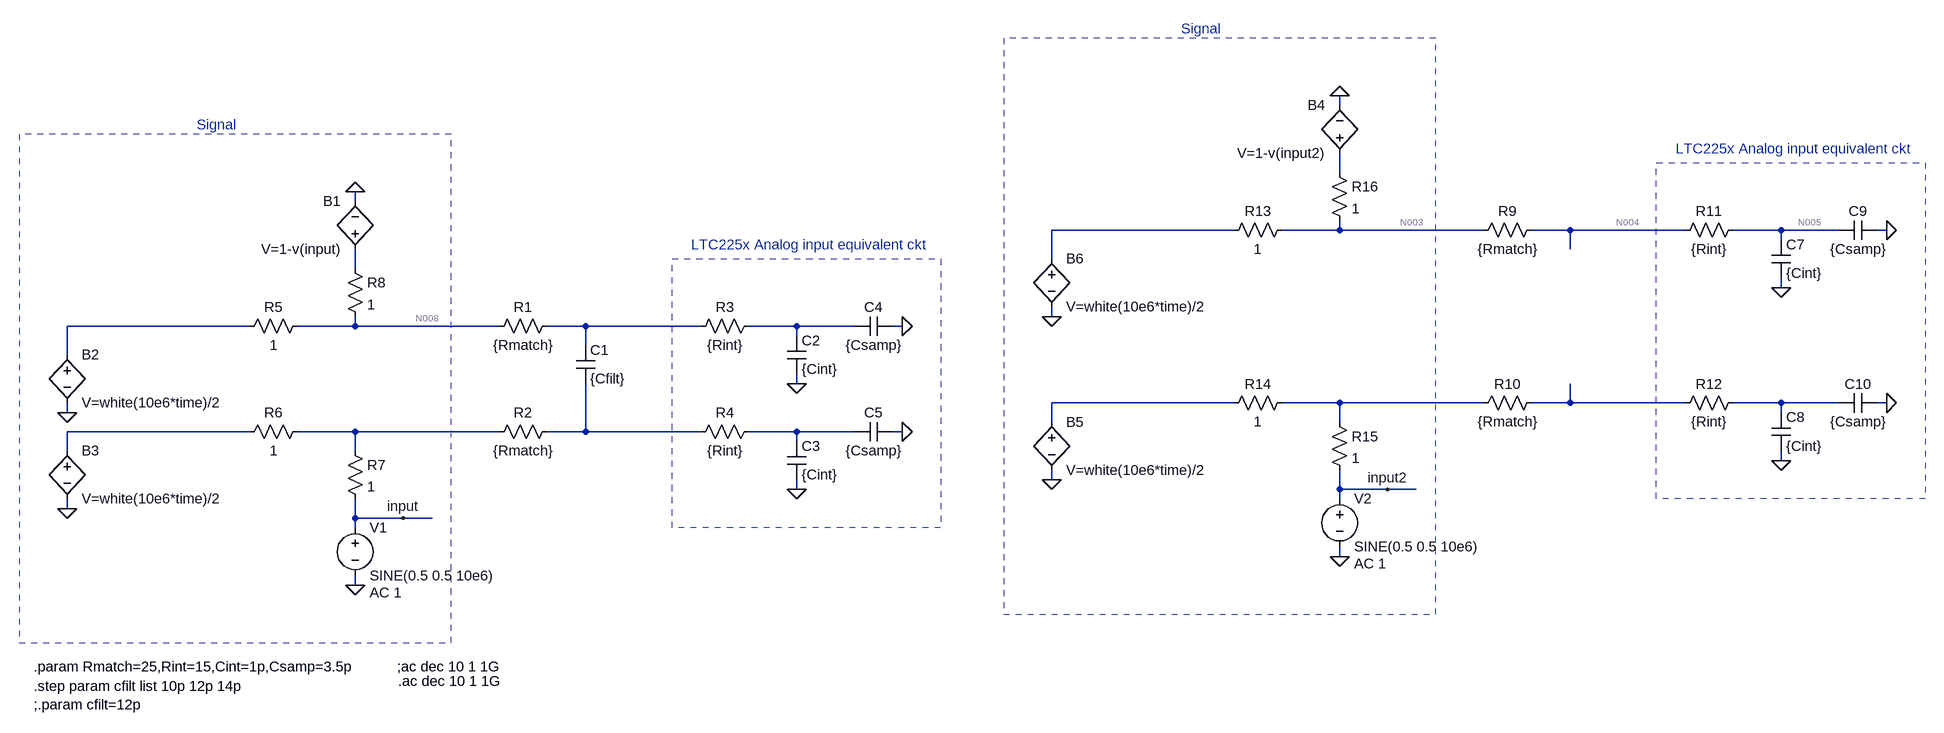
[diagram p0: schematic inputmatching.asc]
inputmatching.asc, the LTspice schematic file:
Version 4
SHEET 1 2676 752
WIRE 1696 -288 1696 -304
WIRE 1696 -176 1696 -208
WIRE -128 -128 -128 -144
WIRE 1520 -80 1216 -80
WIRE 1696 -80 1696 -96
WIRE 1696 -80 1600 -80
WIRE 1936 -80 1696 -80
WIRE 2080 -80 2016 -80
WIRE 2272 -80 2080 -80
WIRE 2432 -80 2352 -80
WIRE 2528 -80 2432 -80
WIRE 2608 -80 2592 -80
WIRE 2432 -64 2432 -80
WIRE 2080 -48 2080 -80
WIRE 1216 -32 1216 -80
WIRE -128 -16 -128 -48
WIRE 2432 16 2432 0
WIRE 1216 64 1216 48
WIRE -304 80 -608 80
WIRE -128 80 -128 64
WIRE -128 80 -224 80
WIRE 112 80 -128 80
WIRE 256 80 192 80
WIRE 448 80 256 80
WIRE 608 80 528 80
WIRE 704 80 608 80
WIRE 784 80 768 80
WIRE 608 96 608 80
WIRE 256 112 256 80
WIRE -608 128 -608 80
WIRE 608 176 608 160
WIRE 1520 208 1216 208
WIRE 1696 208 1600 208
WIRE 1936 208 1696 208
WIRE 2080 208 2080 176
WIRE 2080 208 2016 208
WIRE 2272 208 2080 208
WIRE 2432 208 2352 208
WIRE 2528 208 2432 208
WIRE 2608 208 2592 208
WIRE -608 224 -608 208
WIRE 2432 224 2432 208
WIRE 1216 240 1216 208
WIRE 1696 240 1696 208
WIRE -304 256 -608 256
WIRE -128 256 -224 256
WIRE 112 256 -128 256
WIRE 256 256 256 176
WIRE 256 256 192 256
WIRE 448 256 256 256
WIRE 608 256 528 256
WIRE 704 256 608 256
WIRE 784 256 768 256
WIRE 608 272 608 256
WIRE -608 288 -608 256
WIRE -128 288 -128 256
WIRE 2432 304 2432 288
WIRE 1216 336 1216 320
WIRE 608 352 608 336
WIRE 1696 352 1696 320
WIRE 1776 352 1696 352
WIRE 1824 352 1776 352
WIRE 1696 368 1696 352
WIRE -608 384 -608 368
WIRE -128 400 -128 368
WIRE -48 400 -128 400
WIRE 0 400 -48 400
WIRE -128 416 -128 400
WIRE 1696 464 1696 448
WIRE -128 512 -128 496
FLAG 608 176 0
FLAG 608 352 0
FLAG 784 256 0
FLAG 784 80 0
FLAG -128 512 0
FLAG -128 -144 0
FLAG -608 384 0
FLAG -608 224 0
FLAG -48 400 input
FLAG 2432 16 0
FLAG 2432 304 0
FLAG 2608 208 0
FLAG 2608 -80 0
FLAG 1696 464 0
FLAG 1696 -304 0
FLAG 1216 336 0
FLAG 1216 64 0
FLAG 1776 352 input2
SYMBOL res 208 64 R90
WINDOW 0 0 56 VBottom 2
WINDOW 3 32 56 VTop 2
SYMATTR InstName R1
SYMATTR Value {Rmatch}
SYMBOL res 208 240 R90
WINDOW 0 0 56 VBottom 2
WINDOW 3 32 56 VTop 2
SYMATTR InstName R2
SYMATTR Value {Rmatch}
SYMBOL cap 240 112 R0
SYMATTR InstName C1
SYMATTR Value {Cfilt}
SYMBOL res 544 64 R90
WINDOW 0 0 56 VBottom 2
WINDOW 3 32 56 VTop 2
SYMATTR InstName R3
SYMATTR Value {Rint}
SYMBOL res 544 240 R90
WINDOW 0 0 56 VBottom 2
WINDOW 3 32 56 VTop 2
SYMATTR InstName R4
SYMATTR Value {Rint}
SYMBOL cap 592 96 R0
SYMATTR InstName C2
SYMATTR Value {Cint}
SYMBOL cap 592 272 R0
SYMATTR InstName C3
SYMATTR Value {Cint}
SYMBOL cap 768 64 R90
WINDOW 0 0 32 VBottom 2
WINDOW 3 32 32 VTop 2
SYMATTR InstName C4
SYMATTR Value {Csamp}
SYMBOL cap 768 240 R90
WINDOW 0 0 32 VBottom 2
WINDOW 3 32 32 VTop 2
SYMATTR InstName C5
SYMATTR Value {Csamp}
SYMBOL voltage -128 400 R0
WINDOW 123 24 124 Left 2
WINDOW 39 0 0 Left 2
SYMATTR InstName V1
SYMATTR Value SINE(0.5 0.5 10e6)
SYMATTR Value2 AC 1
SYMBOL bv -128 -32 R180
WINDOW 0 24 96 Left 2
WINDOW 3 24 16 Left 2
SYMATTR InstName B1
SYMATTR Value V=1-v(input)
SYMBOL bv -608 272 R0
SYMATTR InstName B3
SYMATTR Value V=white(10e6*time)/2
SYMBOL bv -608 112 R0
SYMATTR InstName B2
SYMATTR Value V=white(10e6*time)/2
SYMBOL res -208 64 R90
WINDOW 0 0 56 VBottom 2
WINDOW 3 32 56 VTop 2
SYMATTR InstName R5
SYMATTR Value 1
SYMBOL res -208 240 R90
WINDOW 0 0 56 VBottom 2
WINDOW 3 32 56 VTop 2
SYMATTR InstName R6
SYMATTR Value 1
SYMBOL res -144 272 R0
SYMATTR InstName R7
SYMATTR Value 1
SYMBOL res -144 -32 R0
SYMATTR InstName R8
SYMATTR Value 1
SYMBOL res 2032 -96 R90
WINDOW 0 0 56 VBottom 2
WINDOW 3 32 56 VTop 2
SYMATTR InstName R9
SYMATTR Value {Rmatch}
SYMBOL res 2032 192 R90
WINDOW 0 0 56 VBottom 2
WINDOW 3 32 56 VTop 2
SYMATTR InstName R10
SYMATTR Value {Rmatch}
SYMBOL res 2368 -96 R90
WINDOW 0 0 56 VBottom 2
WINDOW 3 32 56 VTop 2
SYMATTR InstName R11
SYMATTR Value {Rint}
SYMBOL res 2368 192 R90
WINDOW 0 0 56 VBottom 2
WINDOW 3 32 56 VTop 2
SYMATTR InstName R12
SYMATTR Value {Rint}
SYMBOL cap 2416 -64 R0
SYMATTR InstName C7
SYMATTR Value {Cint}
SYMBOL cap 2416 224 R0
SYMATTR InstName C8
SYMATTR Value {Cint}
SYMBOL cap 2592 -96 R90
WINDOW 0 0 32 VBottom 2
WINDOW 3 32 32 VTop 2
SYMATTR InstName C9
SYMATTR Value {Csamp}
SYMBOL cap 2592 192 R90
WINDOW 0 0 32 VBottom 2
WINDOW 3 32 32 VTop 2
SYMATTR InstName C10
SYMATTR Value {Csamp}
SYMBOL voltage 1696 352 R0
WINDOW 123 24 124 Left 2
WINDOW 39 0 0 Left 2
SYMATTR InstName V2
SYMATTR Value SINE(0.5 0.5 10e6)
SYMATTR Value2 AC 1
SYMBOL bv 1696 -192 R180
WINDOW 0 24 96 Left 2
WINDOW 3 24 16 Left 2
SYMATTR InstName B4
SYMATTR Value V=1-v(input2)
SYMBOL bv 1216 224 R0
SYMATTR InstName B5
SYMATTR Value V=white(10e6*time)/2
SYMBOL bv 1216 -48 R0
SYMATTR InstName B6
SYMATTR Value V=white(10e6*time)/2
SYMBOL res 1616 -96 R90
WINDOW 0 0 56 VBottom 2
WINDOW 3 32 56 VTop 2
SYMATTR InstName R13
SYMATTR Value 1
SYMBOL res 1616 192 R90
WINDOW 0 0 56 VBottom 2
WINDOW 3 32 56 VTop 2
SYMATTR InstName R14
SYMATTR Value 1
SYMBOL res 1680 224 R0
SYMATTR InstName R15
SYMATTR Value 1
SYMBOL res 1680 -192 R0
SYMATTR InstName R16
SYMATTR Value 1
TEXT -664 648 Left 2 !.param Rmatch=25,Rint=15,Cint=1p,Csamp=3.5p
TEXT -664 680 Left 2 !.step param cfilt list 10p 12p 14p\n;.param cfilt=12p
TEXT -58 648 Left 2 !;ac dec 10 1 1G
TEXT -392 -256 Left 2 ;Signal
TEXT 432 -56 Left 2 ;LTC225x Analog input equivalent ckt
TEXT -56 672 Left 2 !.ac dec 10 1 1G
TEXT 1432 -416 Left 2 ;Signal
TEXT 2256 -216 Left 2 ;LTC225x Analog input equivalent ckt
RECTANGLE Normal -688 608 32 -240 1
RECTANGLE Normal 848 416 400 -32 1
RECTANGLE Normal 1136 560 1856 -400 1
RECTANGLE Normal 2672 368 2224 -192 1

The netlist it stands for:
* inputmatching.asc
R1 N009 N008 {Rmatch}
R2 N017 N016 {Rmatch}
C1 N009 N017 {Cfilt}
R3 N010 N009 {Rint}
R4 N018 N017 {Rint}
C2 N010 0 {Cint}
C3 N018 0 {Cint}
C4 0 N010 {Csamp}
C5 0 N018 {Csamp}
V1 input 0 SINE(0.5 0.5 10e6) AC 1
B1 N006 0 V=1-v(input)
B3 N015 0 V=white(10e6*time)/2
B2 N007 0 V=white(10e6*time)/2
R5 N008 N007 1
R6 N016 N015 1
R7 N016 input 1
R8 N006 N008 1
R9 N004 N003 {Rmatch}
R10 N013 N012 {Rmatch}
R11 N005 N004 {Rint}
R12 N014 N013 {Rint}
C7 N005 0 {Cint}
C8 N014 0 {Cint}
C9 0 N005 {Csamp}
C10 0 N014 {Csamp}
V2 input2 0 SINE(0.5 0.5 10e6) AC 1
B4 N001 0 V=1-v(input2)
B5 N011 0 V=white(10e6*time)/2
B6 N002 0 V=white(10e6*time)/2
R13 N003 N002 1
R14 N012 N011 1
R15 N012 input2 1
R16 N001 N003 1
.param Rmatch=25,Rint=15,Cint=1p,Csamp=3.5p
.step param cfilt list 10p 12p 14p
;.param cfilt=12p
;ac dec 10 1 1G
* Signal
* LTC225x Analog input equivalent ckt
.ac dec 10 1 1G
* Signal
* LTC225x Analog input equivalent ckt
.backanno
.end

* Results of the author's LTspice run, read from the files saved beside the schematic
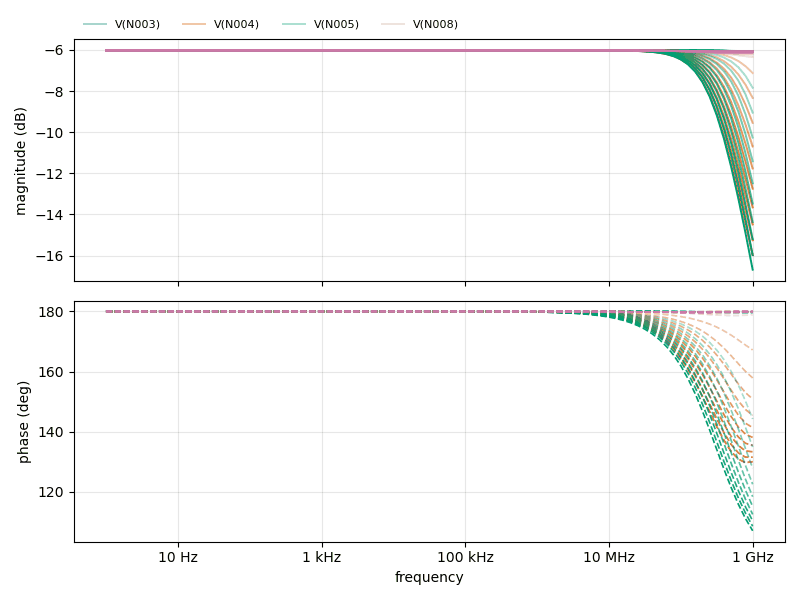
[diagram p1: AC Analysis of inputmatching.asc, plotted from the saved traces]
* AC Analysis, 10 runs:
*   V(N003) [rmatch=10]: -6.02 dB at 1 Hz, -6.08 dB at 1 GHz, peak -6.02 dB at 1 Hz
*   V(N003) [rmatch=20]: -6.02 dB at 1 Hz, -6.08 dB at 1 GHz, peak -6.02 dB at 1 Hz
*   V(N003) [rmatch=30]: -6.02 dB at 1 Hz, -6.08 dB at 1 GHz, peak -6.02 dB at 1 Hz
*   V(N003) [rmatch=40]: -6.02 dB at 1 Hz, -6.08 dB at 1 GHz, peak -6.02 dB at 1 Hz
*   V(N003) [rmatch=50]: -6.02 dB at 1 Hz, -6.07 dB at 1 GHz, peak -6.02 dB at 1 Hz
*   V(N003) [rmatch=60]: -6.02 dB at 1 Hz, -6.07 dB at 1 GHz, peak -6.02 dB at 1 Hz
*   V(N003) [rmatch=70]: -6.02 dB at 1 Hz, -6.06 dB at 1 GHz, peak -6.02 dB at 1 Hz
*   V(N003) [rmatch=80]: -6.02 dB at 1 Hz, -6.06 dB at 1 GHz, peak -6.02 dB at 1 Hz
*   V(N004) [rmatch=10]: -6.02 dB at 1 Hz, -7.12 dB at 1 GHz, peak -6.02 dB at 1 Hz
*   V(N004) [rmatch=20]: -6.02 dB at 1 Hz, -8.33 dB at 1 GHz, peak -6.02 dB at 1 Hz
*   V(N004) [rmatch=30]: -6.02 dB at 1 Hz, -9.54 dB at 1 GHz, peak -6.02 dB at 1 Hz, 3 dB below the peak at 875.1 MHz
*   V(N004) [rmatch=40]: -6.02 dB at 1 Hz, -10.70 dB at 1 GHz, peak -6.02 dB at 1 Hz, 3 dB below the peak at 686.4 MHz
*   V(N004) [rmatch=50]: -6.02 dB at 1 Hz, -11.77 dB at 1 GHz, peak -6.02 dB at 1 Hz, 3 dB below the peak at 567.6 MHz
*   V(N004) [rmatch=60]: -6.02 dB at 1 Hz, -12.75 dB at 1 GHz, peak -6.02 dB at 1 Hz, 3 dB below the peak at 486.8 MHz
*   V(N004) [rmatch=70]: -6.02 dB at 1 Hz, -13.66 dB at 1 GHz, peak -6.02 dB at 1 Hz, 3 dB below the peak at 425 MHz
*   V(N004) [rmatch=80]: -6.02 dB at 1 Hz, -14.49 dB at 1 GHz, peak -6.02 dB at 1 Hz, 3 dB below the peak at 378.2 MHz
*   V(N005) [rmatch=10]: -6.02 dB at 1 Hz, -7.84 dB at 1 GHz, peak -6.02 dB at 19.95 Hz
*   V(N005) [rmatch=20]: -6.02 dB at 1 Hz, -9.05 dB at 1 GHz, peak -6.02 dB at 1 Hz, 3 dB below the peak at 995.8 MHz
*   V(N005) [rmatch=30]: -6.02 dB at 1 Hz, -10.26 dB at 1 GHz, peak -6.02 dB at 1 Hz, 3 dB below the peak at 775.4 MHz
*   V(N005) [rmatch=40]: -6.02 dB at 1 Hz, -11.41 dB at 1 GHz, peak -6.02 dB at 1 Hz, 3 dB below the peak at 636.6 MHz
*   V(N005) [rmatch=50]: -6.02 dB at 1 Hz, -12.48 dB at 1 GHz, peak -6.02 dB at 1 Hz, 3 dB below the peak at 537 MHz
*   V(N005) [rmatch=60]: -6.02 dB at 1 Hz, -13.47 dB at 1 GHz, peak -6.02 dB at 1 Hz, 3 dB below the peak at 465.8 MHz
*   V(N005) [rmatch=70]: -6.02 dB at 1 Hz, -14.37 dB at 1 GHz, peak -6.02 dB at 1 Hz, 3 dB below the peak at 412.3 MHz
*   V(N005) [rmatch=80]: -6.02 dB at 1 Hz, -15.21 dB at 1 GHz, peak -6.02 dB at 1 Hz, 3 dB below the peak at 368.1 MHz
*   V(N008) [rmatch=10]: -6.02 dB at 1 Hz, -6.34 dB at 1 GHz, peak -6.02 dB at 1 Hz
*   V(N008) [rmatch=20]: -6.02 dB at 1 Hz, -6.22 dB at 1 GHz, peak -6.02 dB at 1 Hz
*   V(N008) [rmatch=30]: -6.02 dB at 1 Hz, -6.16 dB at 1 GHz, peak -6.02 dB at 1 Hz
*   V(N008) [rmatch=40]: -6.02 dB at 1 Hz, -6.13 dB at 1 GHz, peak -6.02 dB at 1 Hz
*   V(N008) [rmatch=50]: -6.02 dB at 1 Hz, -6.11 dB at 1 GHz, peak -6.02 dB at 1 Hz
*   V(N008) [rmatch=60]: -6.02 dB at 1 Hz, -6.09 dB at 1 GHz, peak -6.02 dB at 1 Hz
*   V(N008) [rmatch=70]: -6.02 dB at 1 Hz, -6.08 dB at 1 GHz, peak -6.02 dB at 1 Hz
*   V(N008) [rmatch=80]: -6.02 dB at 1 Hz, -6.07 dB at 1 GHz, peak -6.02 dB at 1 Hz